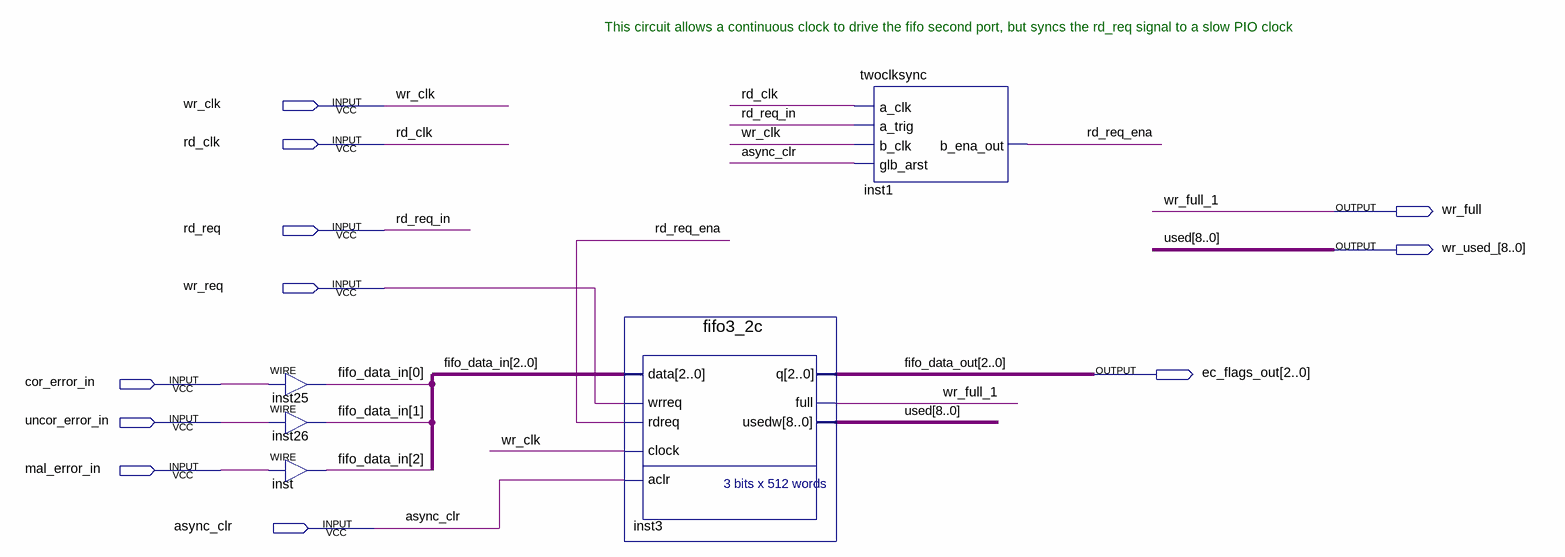
[diagram p0: schematic sheet]
// Quartus schematic fifo_ec_correct_flags.bdf as structural Verilog: 5 symbols, 11 pins
module fifo_ec_correct_flags (
  input  wr_clk,
  input  rd_clk,
  input  rd_req,
  input  wr_req,
  input  cor_error_in,
  input  uncor_error_in,
  input  mal_error_in,
  input  async_clr,
  output wr_full,
  output [8:0] wr_used_,
  output [2:0] ec_flags_out
);

  wire rd_req_ena;
  wire [2:0] fifo_data_in;

  assign fifo_data_in[0] = cor_error_in;  // WIRE inst25
  assign fifo_data_in[1] = uncor_error_in;  // WIRE inst26
  assign fifo_data_in[2] = mal_error_in;  // WIRE inst
  fifo3_2c inst3 (
    .data(fifo_data_in), .wrreq(wr_req), .rdreq(rd_req_ena), .clock(wr_clk), .aclr(async_clr),
    .q(ec_flags_out), .full(wr_full), .usedw(wr_used_));
  twoclksync inst1 (.a_clk(rd_clk), .b_clk(wr_clk), .glb_arst(async_clr), .a_trig(rd_req), .b_ena_out(rd_req_ena));

  // Other names for the same wires on the sheet: fifo_data_out[2:0] = ec_flags_out; rd_req_in = rd_req;
  //   used[8:0] = wr_used_; wr_full_1 = wr_full

  // Notes on the sheet:
  //   This circuit allows a continuous clock to drive the fifo second port, but syncs the rd_req signal to a slow PIO clock
endmodule
